# Altium project PMSM_SBC.PrjPcb
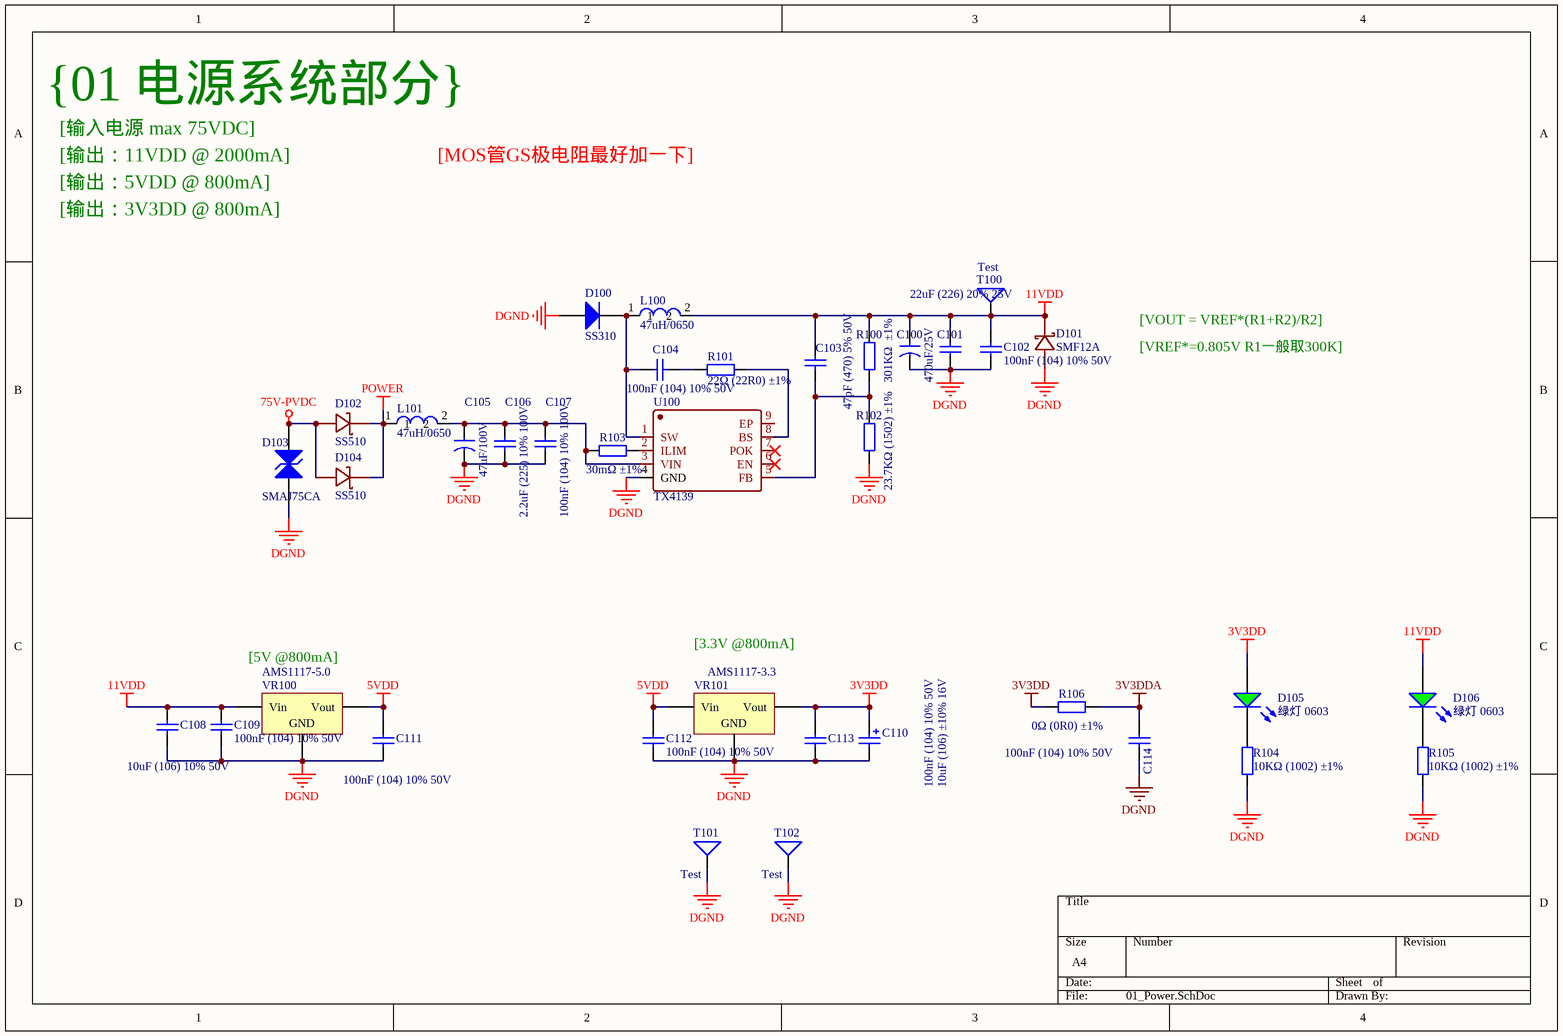
[diagram p0: 01_Power.SchDoc]
5 sheets, 177 parts. Net scope: global (net labels, ports and power ports of the same name join across sheets).
Board file: PMSM_Driver_V0.16.PcbDoc
Sheets:
  01_Power.SchDoc
  02_Sensor.SchDoc
  03_MOS_Drive.SchDoc
  04_Mcu.SchDoc
  05_Peripheral.SchDoc

## Sheet 01_Power.SchDoc
size A4

### Parts
C100  470uF/25V  [47UF/100V]
C101  22uF (226) 20% 25V  [LC-0805_C]
C102  100nF (104) 10% 50V  [LC-0603_C]
C103  47pF (470) 5% 50V  [LC-0603_C]
C104  100nF (104) 10% 50V  [LC-0603_C]
C105  47uF/100V  [47UF/100V]
C106  2.2uF (225) 10% 100V  [LC-1206_C]
C107  100nF (104) 10% 100V  [LC-1206_C]
C108  10uF (106) 10% 50V  [LC-1206_C]
C109  100nF (104) 10% 50V  [LC-0603_C]
C110  10uF (106) ±10% 16V  [LC-CASE-A_3216]
C111  100nF (104) 10% 50V  [LC-0603_C]
C112  100nF (104) 10% 50V  [LC-0603_C]
C113  100nF (104) 10% 50V  [LC-0603_C]
C114  100nF (104) 10% 50V  [LC-0603_C]
D100  SS310  [LC-SMA(DO-214AC)_S1]
D101  SMF12A  [SMF12A - duplicate]
D102  SS510  [SS510]
D103  SMAJ75CA  [LC-SMB(DO-214AA)_S1]
D104  SS510  [SS510]
D105  绿灯 0603  [LC-0603_LED_S1]
D106  绿灯 0603  [LC-0603_LED_S1]
L100  47uH/0650  [0650_47uH]
L101  47uH/0650  [0650_47uH]
R100  301KΩ  ±1%  [LC-0603_R]
R101  22Ω (22R0) ±1%  [LC-0603_R]
R102  23.7KΩ (1502) ±1%  [LC-0603_R]
R103  30mΩ ±1%  [LC-0603_R]
R104  10KΩ (1002) ±1%  [LC-0603_R]
R105  10KΩ (1002) ±1%  [LC-0603_R]
R106  0Ω (0R0) ±1%  [LC-0603_R]
T100  Test  [Testpoint]
T101  Test  [Testpoint]
T102  Test  [Testpoint]
U100  TX4139  [ESOP8]
VR100  AMS1117-5.0  [LC-SOT-223]
VR101  AMS1117-3.3  [LC-SOT-223]

### Nets
3V3DD: C110.1 C113.2 D105.A R106.1 VR101.2(Vout)
3V3DDA: C114.2 R106.2
5VDD: C111.2 C112.2 VR100.2(Vout) VR101.3(Vin)
11VDD: C100.1 C101.2 C102.2 C103.2 C108.2 C109.2 D101.1(K) D106.A L100.2 R100.2 T100.1 VR100.3(Vin)
75V-PVDC: D102.2 D103.2(K) D104.2
DGND: C100.2 C101.1 C102.1 C105.2 C106.1 C107.1 C108.1 C109.1 C110.2 C111.1 C112.1 C113.1 C114.1 D100.1(A) D101.2(A) D103.1(A) R102.1 R104.1 R105.1 T101.1 T102.1 U100.4(GND) VR100.1(GND) VR101.1(GND)
POWER: D102.1 D104.1 L101.1
NetC103_1: C103.1 R100.1 R102.2 U100.5(FB)
NetC104_1: C104.1 D100.2(K) L100.1 U100.1(SW)
NetC104_2: C104.2 R101.1
NetC105_1: C105.1 C106.2 C107.2 L101.2 R103.2 U100.3(VIN)
NetD105_K: D105.K R104.2
NetD106_K: D106.K R105.2
NetR101_2: R101.2 U100.8(BS)
NetR103_1: R103.1 U100.2(ILIM)

Not connected (* = marked no-connect by the designer): U100 6(EN)* 7(POK)* 9(EP)

### Notes on the sheet
- {01 电源系统部分}
- [输入电源 max 75VDC]
- [输出：11VDD @ 2000mA]
- [MOS管GS极电阻最好加一下]
- [输出：5VDD @ 800mA]
- [输出：3V3DD @ 800mA]
- [VOUT = VREF*(R1+R2)/R2]
- [VREF*=0.805V R1一般取300K]
- [3.3V @800mA]
- [5V @800mA]

### Library data of the parts
C100 C105 = CapSMT220u_16V
C101 = 0805 22uF (226) 20% 25V: 贴片电容; ComponentLink1Description: 供应商链接; ComponentLink1URL: http://www.szlcsc.com/product/details_46786.html; Package: 0805; Supplier: LC; SuppliersPartNumber: C45783
C102 C104 C109 C111-C114 = 0603 100nF (104) 10% 50V: 贴片电容; ComponentLink1Description: 供应商链接; ComponentLink1URL: http://www.szlcsc.com/product/details_15331.html; Package: 0603; Supplier: LC; SuppliersPartNumber: C14663
C103 = 0603 47pF (470) 5% 50V: 贴片电容; ComponentLink1Description: 供应商链接; ComponentLink1URL: http://www.szlcsc.com/product/details_2023.html; Package: 0603; Supplier: LC; SuppliersPartNumber: C1671
C106 = 1206 2.2uF (225) 10% 50V: 贴片电容; ComponentLink1Description: 供应商链接; ComponentLink1URL: http://www.szlcsc.com/product/details_13292.html; Package: 1206; Supplier: LC; SuppliersPartNumber: C12656
C107 = 1206 100nF (104) 10% 50V: 贴片电容; ComponentLink1Description: 供应商链接; ComponentLink1URL: http://www.szlcsc.com/product/details_25237.html; Package: 1206; Supplier: LC; SuppliersPartNumber: C24497
C108 = 1206 10uF (106) 10% 50V: 贴片电容; ComponentLink1Description: 供应商链接; ComponentLink1URL: http://www.szlcsc.com/product/details_14236.html; Package: 1206; Supplier: LC; SuppliersPartNumber: C13585
C110 = 3216 10uF (106) 10% 16V: 钽电容; ComponentLink1Description: 供应商链接; ComponentLink1URL: http://www.szlcsc.com/product/details_7643.html; Package: 3216; Supplier: LC; SuppliersPartNumber: C7171
D100 = SMA(DO-214AC) SS54: 二极管; ComponentLink1Description: 供应商链接; ComponentLink1URL: http://www.szlcsc.com/product/details_23178.html; Package: SMA(DO-214AC); Supplier: LC; SuppliersPartNumber: C22452
D103 = SMB/DO-214AA P6SMB6.8CA: TVS; ComponentLink1Description: 供应商链接; ComponentLink1URL: http://www.szlcsc.com/product/details_79530.html; Package: SMB/DO-214AA; Supplier: LC; SuppliersPartNumber: C78395
D105 D106 = 0603 绿灯: 发光二极管; ComponentLink1Description: 供应商链接; ComponentLink1URL: http://www.szlcsc.com/product/details_73152.html; Package: 0603; Supplier: LC; SuppliersPartNumber: C72043
L100 L101 = Inductor
R100 = 0603 330KΩ (3303) 1%: 贴片电阻; ComponentLink1Description: 供应商链接; ComponentLink1URL: http://www.szlcsc.com/product/details_23864.html; Package: 0603; Supplier: LC; SuppliersPartNumber: C23137
R101 = 0603 22Ω (22R0) 1%: 贴片电阻; ComponentLink1Description: 供应商链接; ComponentLink1URL: http://www.szlcsc.com/product/details_24078.html; Package: 0603; Supplier: LC; SuppliersPartNumber: C23345
R102 = 0603 15KΩ (1502) 1%: 贴片电阻; ComponentLink1Description: 供应商链接; ComponentLink1URL: http://www.szlcsc.com/product/details_23536.html; Package: 0603; Supplier: LC; SuppliersPartNumber: C22809
R103 = 0603 100KΩ (1003) 1%: 贴片电阻; ComponentLink1Description: 供应商链接; ComponentLink1URL: http://www.szlcsc.com/product/details_26546.html; Package: 0603; Supplier: LC; SuppliersPartNumber: C25803
R104 R105 = 0603 10KΩ (1002) 1%: 贴片电阻; ComponentLink1Description: 供应商链接; ComponentLink1URL: http://www.szlcsc.com/product/details_26547.html; Package: 0603; Supplier: LC; SuppliersPartNumber: C25804
R106 = 0603 0Ω (0R0) 1%: 贴片电阻; ComponentLink1Description: 供应商链接; ComponentLink1URL: http://www.szlcsc.com/product/details_21903.html; Package: 0603; Supplier: LC; SuppliersPartNumber: C21189
T100-T102 = TestPad
VR100 = SOT-223 AMS1117-5.0: 低压差线性稳压(LDO); ComponentLink1Description: 供应商链接; ComponentLink1URL: http://www.szlcsc.com/product/details_6653.html; Package: SOT-223; Supplier: LC; SuppliersPartNumber: C6187
VR101 = SOT-223 AMS1117-3.3: 低压差线性稳压(LDO); ComponentLink1Description: 供应商链接; ComponentLink1URL: http://www.szlcsc.com/product/details_6652.html; Package: SOT-223; Supplier: LC; SuppliersPartNumber: C6186

## Sheet 02_Sensor.SchDoc
size A4
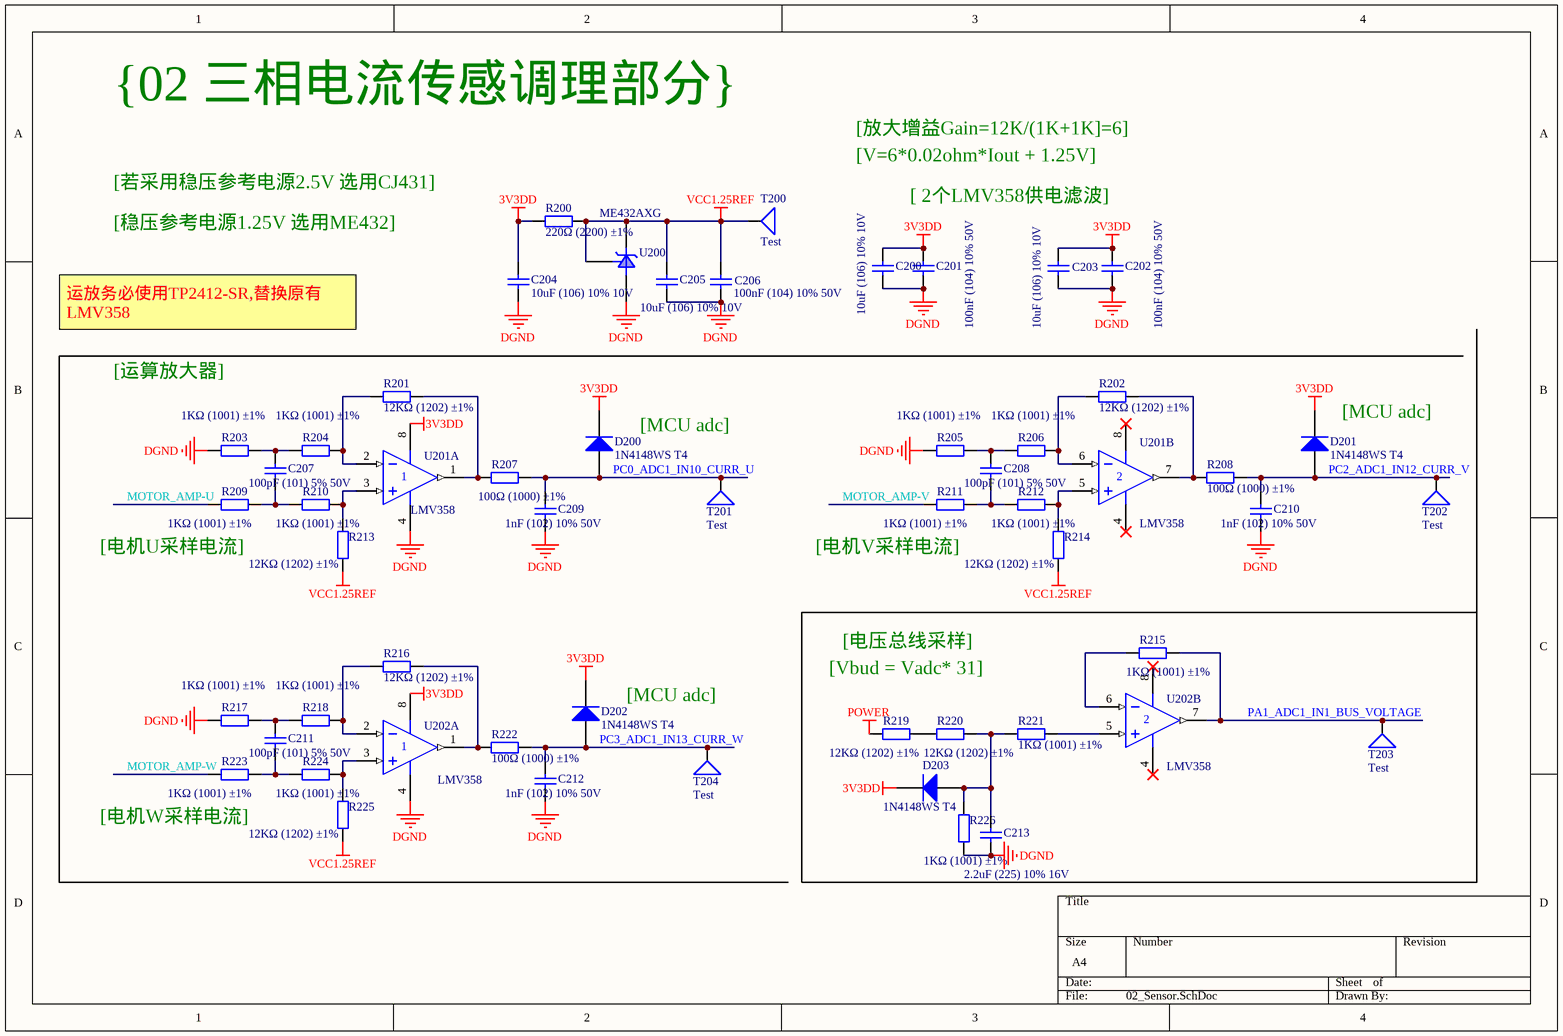
[diagram p1: 02_Sensor.SchDoc]

### Parts
C200  10uF (106) 10% 10V  [LC-0603_C]
C201  100nF (104) 10% 50V  [LC-0603_C]
C202  100nF (104) 10% 50V  [LC-0603_C]
C203  10uF (106) 10% 10V  [LC-0603_C]
C204  10uF (106) 10% 10V  [LC-0603_C]
C205  10uF (106) 10% 10V  [LC-0603_C]
C206  100nF (104) 10% 50V  [LC-0603_C]
C207  100pF (101) 5% 50V  [LC-0603_C]
C208  100pF (101) 5% 50V  [LC-0603_C]
C209  1nF (102) 10% 50V  [LC-0603_C]
C210  1nF (102) 10% 50V  [LC-0603_C]
C211  100pF (101) 5% 50V  [LC-0603_C]
C212  1nF (102) 10% 50V  [LC-0603_C]
C213  2.2uF (225) 10% 16V  [LC-0603_C]
D200  1N4148WS T4  [LC-SOD-323]
D201  1N4148WS T4  [LC-SOD-323]
D202  1N4148WS T4  [LC-SOD-323]
D203  1N4148WS T4  [LC-SOD-323]
R200  220Ω (2200) ±1%  [LC-0603_R]
R201  12KΩ (1202) ±1%  [LC-0603_R]
R202  12KΩ (1202) ±1%  [LC-0603_R]
R203  1KΩ (1001) ±1%  [LC-0603_R]
R204  1KΩ (1001) ±1%  [LC-0603_R]
R205  1KΩ (1001) ±1%  [LC-0603_R]
R206  1KΩ (1001) ±1%  [LC-0603_R]
R207  100Ω (1000) ±1%  [LC-0603_R]
R208  100Ω (1000) ±1%  [LC-0603_R]
R209  1KΩ (1001) ±1%  [LC-0603_R]
R210  1KΩ (1001) ±1%  [LC-0603_R]
R211  1KΩ (1001) ±1%  [LC-0603_R]
R212  1KΩ (1001) ±1%  [LC-0603_R]
R213  12KΩ (1202) ±1%  [LC-0603_R]
R214  12KΩ (1202) ±1%  [LC-0603_R]
R215  1KΩ (1001) ±1%  [LC-0603_R]
R216  12KΩ (1202) ±1%  [LC-0603_R]
R217  1KΩ (1001) ±1%  [LC-0603_R]
R218  1KΩ (1001) ±1%  [LC-0603_R]
R219  12KΩ (1202) ±1%  [LC-0603_R]
R220  12KΩ (1202) ±1%  [LC-0603_R]
R221  1KΩ (1001) ±1%  [LC-0603_R]
R222  100Ω (1000) ±1%  [LC-0603_R]
R223  1KΩ (1001) ±1%  [LC-0603_R]
R224  1KΩ (1001) ±1%  [LC-0603_R]
R225  12KΩ (1202) ±1%  [LC-0603_R]
R226  1KΩ (1001) ±1%  [LC-0603_R]
T200  Test  [Testpoint]
T201  Test  [Testpoint]
T202  Test  [Testpoint]
T203  Test  [Testpoint]
T204  Test  [Testpoint]
U200  ME432AXG  [LC-SOT-23(SOT-23-3)]
U201  LMV358  [TP2412-SR]  (parts A,B of 2)
U202  LMV358  [TP2412-SR]  (parts A,B of 2)

### Nets
3V3DD: C200.2 C201.2 C202.2 C203.2 C204.2 D200.2(K) D201.2(K) D202.2(K) D203.2(K) R200.1 U201.8(V+) U202.8(V+)
DGND: C200.1 C201.1 C202.1 C203.1 C204.1 C205.1 C206.1 C209.1 C210.1 C212.1 C213.1 R203.1 R205.1 R217.1 R226.1 U200.3(A) U201.4(V-) U202.4(V-)
POWER: R219.1
VCC1.25REF: C205.2 C206.2 R200.2 R213.1 R214.1 R225.1 T200.1 U200.1(R) U200.2(K)
MOTOR_AMP-U: R209.1
MOTOR_AMP-V: R211.1
MOTOR_AMP-W: R223.1
PA1_ADC1_IN1_BUS_VOLTAGE: R215.2 T203.1 U202.7(OUT)
PC0_ADC1_IN10_CURR_U: C209.2 D200.1(A) R207.2 T201.1
PC2_ADC1_IN12_CURR_V: C210.2 D201.1(A) R208.2 T202.1
PC3_ADC1_IN13_CURR_W: C212.2 D202.1(A) R222.2 T204.1
NetC207_1: C207.1 R209.2 R210.2
NetC207_2: C207.2 R203.2 R204.2
NetC208_1: C208.1 R211.2 R212.2
NetC208_2: C208.2 R205.2 R206.2
NetC211_1: C211.1 R223.2 R224.2
NetC211_2: C211.2 R217.2 R218.2
NetC213_2: C213.2 D203.1(A) R220.2 R221.2 R226.2
NetR201_1: R201.1 R207.1 U201.1(OUT)
NetR201_2: R201.2 R204.1 U201.2(IN-)
NetR202_1: R202.1 R208.1 U201.7(OUT)
NetR202_2: R202.2 R206.1 U201.6(IN-)
NetR210_1: R210.1 R213.2 U201.3(IN+)
NetR212_1: R212.1 R214.2 U201.5(IN+)
NetR215_1: R215.1 U202.6(IN-)
NetR216_1: R216.1 R222.1 U202.1(OUT)
NetR216_2: R216.2 R218.1 U202.2(IN-)
NetR219_2: R219.2 R220.1
NetR221_1: R221.1 U202.5(IN+)
NetR224_1: R224.1 R225.2 U202.3(IN+)

### Notes on the sheet
- {02 三相电流传感调理部分}
- [放大增益Gain=12K/(1K+1K]=6]
- [V=6*0.02ohm*Iout + 1.25V]
- [若采用稳压参考电源2.5V 选用CJ431]
- [稳压参考电源1.25V 选用ME432]
- [ 2个LMV358供电滤波]
- 运放务必使用TP2412-SR,替换原有LMV358
- [运算放大器]
- [MCU adc]
- (near D201) [MCU adc]
- (near R209) [电机U采样电流]
- (near R211) [电机V采样电流]
- [电压总线采样]
- [Vbud = Vadc* 31]
- (near R223) [电机W采样电流]

### Library data of the parts
C200 C203-C205 = 0603 10uF (106) 10% 10V: 贴片电容; ComponentLink1Description: 供应商链接; ComponentLink1URL: http://www.szlcsc.com/product/details_20411.html; Package: 0603; Supplier: LC; SuppliersPartNumber: C19702
C201 C202 C206 = 0603 100nF (104) 10% 50V: 贴片电容; ComponentLink1Description: 供应商链接; ComponentLink1URL: http://www.szlcsc.com/product/details_15331.html; Package: 0603; Supplier: LC; SuppliersPartNumber: C14663
C207 C208 C211 = 0603 100pF (101) 5% 50V: 贴片电容; ComponentLink1Description: 供应商链接; ComponentLink1URL: http://www.szlcsc.com/product/details_15530.html; Package: 0603; Supplier: LC; SuppliersPartNumber: C14858
C209 C210 C212 = 0603 1nF (102) 10% 50V: 贴片电容; ComponentLink1Description: 供应商链接; ComponentLink1URL: http://www.szlcsc.com/product/details_1940.html; Package: 0603; Supplier: LC; SuppliersPartNumber: C1588
C213 = 0603 2.2uF (225) 10% 16V: 贴片电容; ComponentLink1Description: 供应商链接; ComponentLink1URL: http://www.szlcsc.com/product/details_24366.html; Package: 0603; Supplier: LC; SuppliersPartNumber: C23630
D200-D203 = SOD-323 1N4148WS T4: 二极管; ComponentLink1Description: 供应商链接; ComponentLink1URL: http://www.szlcsc.com/product/details_2485.html; Package: SOD-323; Supplier: LC; SuppliersPartNumber: C2128
R200 = 0603 220Ω (2200) 1%: 贴片电阻; ComponentLink1Description: 供应商链接; ComponentLink1URL: http://www.szlcsc.com/product/details_23689.html; Package: 0603; Supplier: LC; SuppliersPartNumber: C22962
R201 R202 R213 R214 R216 R219 R220 R225 = 0603 12KΩ (1202) 1%: 贴片电阻; ComponentLink1Description: 供应商链接; ComponentLink1URL: http://www.szlcsc.com/product/details_23517.html; Package: 0603; Supplier: LC; SuppliersPartNumber: C22790
R203-R206 R209-R212 R215 R217 R218 R221 R223 R224 R226 = 0603 1KΩ (1001) 1%: 贴片电阻; ComponentLink1Description: 供应商链接; ComponentLink1URL: http://www.szlcsc.com/product/details_21904.html; Package: 0603; Supplier: LC; SuppliersPartNumber: C21190
R207 R208 R222 = 0603 100Ω (1000) 1%: 贴片电阻; ComponentLink1Description: 供应商链接; ComponentLink1URL: http://www.szlcsc.com/product/details_23502.html; Package: 0603; Supplier: LC; SuppliersPartNumber: C22775
T200-T204 = TestPad
U200 = CJ431 0.5%431: 电压基准; ComponentLink1Description: 供应商链接; ComponentLink1URL: http://www.szlcsc.com/product/details_3500.html; Package: SOT-23; Supplier: LC; SuppliersPartNumber: C3113
U201 U202 = LM358DR2G: 通用运放; ComponentLink1Description: 供应商链接; ComponentLink1URL: http://www.szlcsc.com/product/details_8427.html; Package: SOIC-8; Supplier: LC; SuppliersPartNumber: C7950

## Sheet 03_MOS_Drive.SchDoc
size A3
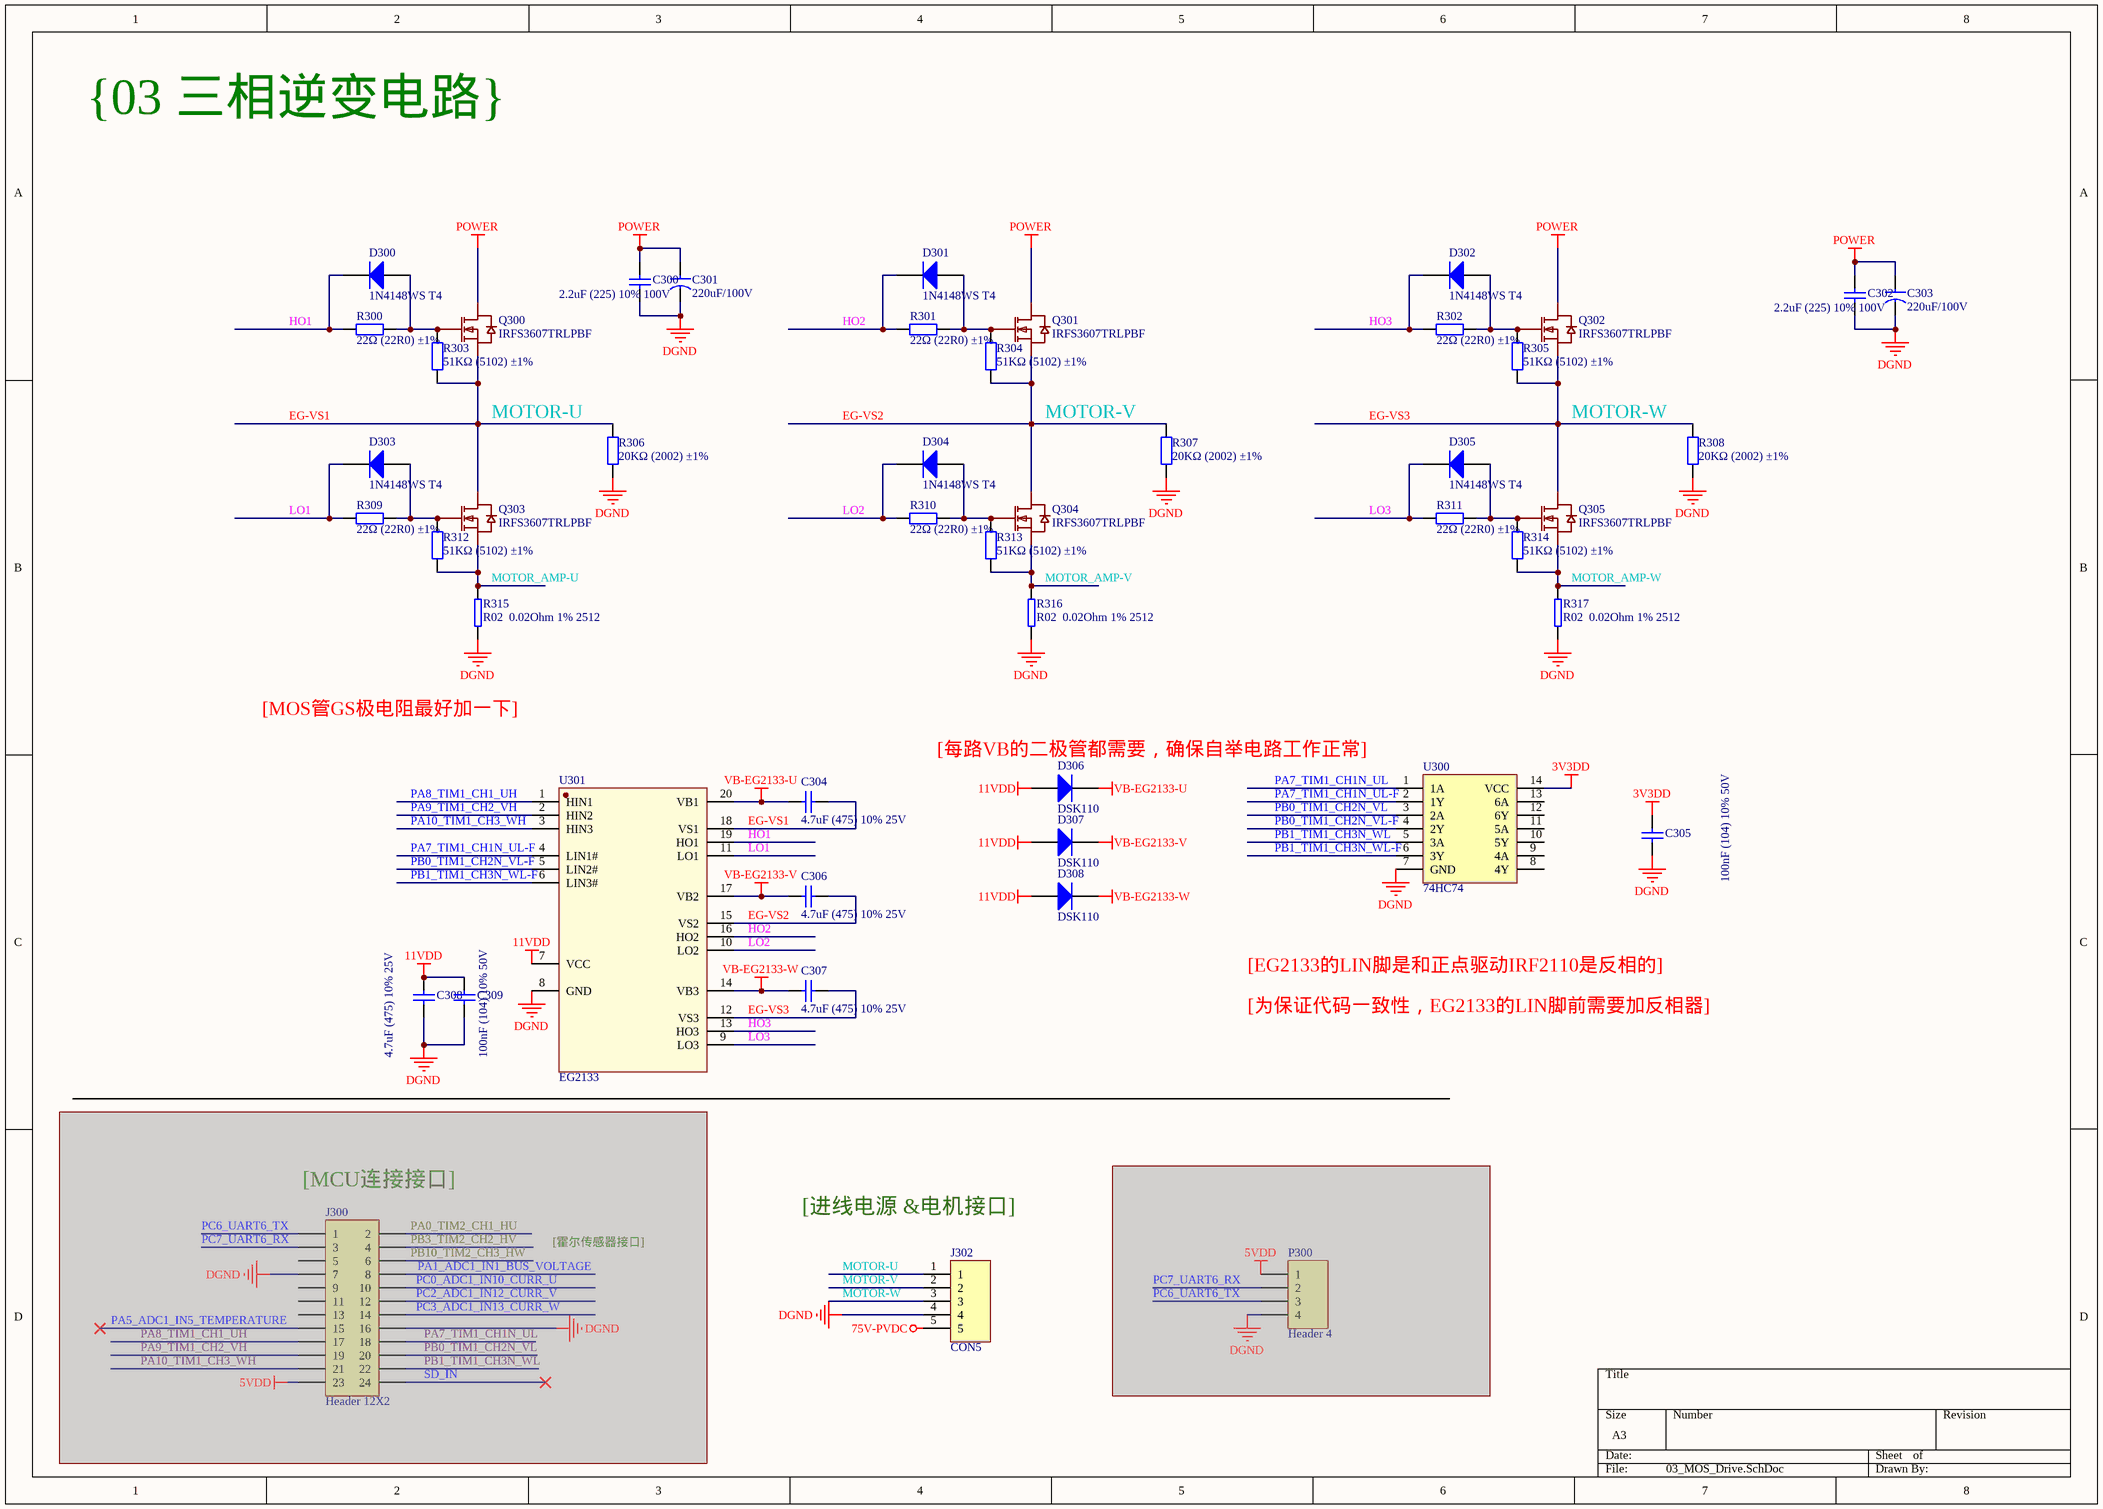
[diagram p2: 03_MOS_Drive.SchDoc]

### Parts
C300  2.2uF (225) 10% 100V  [LC-1206_C]
C301  220uF/100V  [220UF/100V]
C302  2.2uF (225) 10% 100V  [LC-1206_C]
C303  220uF/100V  [220UF/100V]
C304  4.7uF (475) 10% 25V  [LC-0805_C]
C305  100nF (104) 10% 50V  [LC-0603_C]
C306  4.7uF (475) 10% 25V  [LC-0805_C]
C307  4.7uF (475) 10% 25V  [LC-0805_C]
C308  4.7uF (475) 10% 25V  [LC-0603_C]
C309  100nF (104) 10% 50V  [LC-0603_C]
D300  1N4148WS T4  [LC-SOD-323]
D301  1N4148WS T4  [LC-SOD-323]
D302  1N4148WS T4  [LC-SOD-323]
D303  1N4148WS T4  [LC-SOD-323]
D304  1N4148WS T4  [LC-SOD-323]
D305  1N4148WS T4  [LC-SOD-323]
D306  DSK110  [DSK110]
D307  DSK110  [DSK110]
D308  DSK110  [DSK110]
J300  Header 12X2  [HDR2X12]  (masked out: inside a compile mask, not in the netlist)
J302  CON5  [7.62-5P 端子]
P300  Header 4  [HDR1X4]  (masked out: inside a compile mask, not in the netlist)
Q300  IRFS3607TRLPBF  [TO-263-2]
Q301  IRFS3607TRLPBF  [TO-263-2]
Q302  IRFS3607TRLPBF  [TO-263-2]
Q303  IRFS3607TRLPBF  [TO-263-2]
Q304  IRFS3607TRLPBF  [TO-263-2]
Q305  IRFS3607TRLPBF  [TO-263-2]
R300  22Ω (22R0) ±1%  [LC-0603_R]
R301  22Ω (22R0) ±1%  [LC-0603_R]
R302  22Ω (22R0) ±1%  [LC-0603_R]
R303  51KΩ (5102) ±1%  [LC-0603_R]
R304  51KΩ (5102) ±1%  [LC-0603_R]
R305  51KΩ (5102) ±1%  [LC-0603_R]
R306  20KΩ (2002) ±1%  [LC-0603_R]
R307  20KΩ (2002) ±1%  [LC-0603_R]
R308  20KΩ (2002) ±1%  [LC-0603_R]
R309  22Ω (22R0) ±1%  [LC-0603_R]
R310  22Ω (22R0) ±1%  [LC-0603_R]
R311  22Ω (22R0) ±1%  [LC-0603_R]
R312  51KΩ (5102) ±1%  [LC-0603_R]
R313  51KΩ (5102) ±1%  [LC-0603_R]
R314  51KΩ (5102) ±1%  [LC-0603_R]
R315  R02  0.02Ohm 1% 2512  [R2512]
R316  R02  0.02Ohm 1% 2512  [R2512]
R317  R02  0.02Ohm 1% 2512  [R2512]
U300  74HC74  [SOIC-14]
U301  EG2133  [TSSOP20]

### Nets
3V3DD: C305.2 U300.14(VCC)
11VDD: C308.2 C309.2 D306.2(A) D307.2(A) D308.2(A) U301.7(VCC)
75V-PVDC: J302.5
DGND: C300.2 C301.2 C302.2 C303.2 C305.1 C308.1 C309.1 J302.4 R306.1 R307.1 R308.1 R315.1 R316.1 R317.1 U300.7(GND) U301.8(GND)
POWER: C300.1 C301.1 C302.1 C303.1 Q300.4(D) Q301.4(D) Q302.4(D)
VB-EG2133-U: C304.1 D306.1(K) U301.20(VB1)
VB-EG2133-V: C306.1 D307.1(K) U301.17(VB2)
VB-EG2133-W: C307.1 D308.1(K) U301.14(VB3)
EG-VS1: C304.2 J302.1 Q300.3(S) Q303.4(D) R303.1 R306.2 U301.18(VS1)  [also labelled MOTOR-U]
EG-VS2: C306.2 J302.2 Q301.3(S) Q304.4(D) R304.1 R307.2 U301.15(VS2)  [also labelled MOTOR-V]
EG-VS3: C307.2 J302.3 Q302.3(S) Q305.4(D) R305.1 R308.2 U301.12(VS3)  [also labelled MOTOR-W]
HO1: D300.2(K) R300.1 U301.19(HO1)
HO2: D301.2(K) R301.1 U301.16(HO2)
HO3: D302.2(K) R302.1 U301.13(HO3)
LO1: D303.2(K) R309.1 U301.11(LO1)
LO2: D304.2(K) R310.1 U301.10(LO2)
LO3: D305.2(K) R311.1 U301.9(LO3)
MOTOR_AMP-U: Q303.3(S) R312.1 R315.2
MOTOR_AMP-V: Q304.3(S) R313.1 R316.2
MOTOR_AMP-W: Q305.3(S) R314.1 R317.2
PA7_TIM1_CH1N_UL: U300.1(1A)
PA7_TIM1_CH1N_UL-F: U300.2(1Y) U301.4(LIN1#)
PA8_TIM1_CH1_UH: U301.1(HIN1)
PA9_TIM1_CH2_VH: U301.2(HIN2)
PA10_TIM1_CH3_WH: U301.3(HIN3)
PB0_TIM1_CH2N_VL: U300.3(2A)
PB0_TIM1_CH2N_VL-F: U300.4(2Y) U301.5(LIN2#)
PB1_TIM1_CH3N_WL: U300.5(3A)
PB1_TIM1_CH3N_WL-F: U300.6(3Y) U301.6(LIN3#)
NetD300_1: D300.1(A) Q300.1(G) R300.2 R303.2
NetD301_1: D301.1(A) Q301.1(G) R301.2 R304.2
NetD302_1: D302.1(A) Q302.1(G) R302.2 R305.2
NetD303_1: D303.1(A) Q303.1(G) R309.2 R312.2
NetD304_1: D304.1(A) Q304.1(G) R310.2 R313.2
NetD305_1: D305.1(A) Q305.1(G) R311.2 R314.2

Not connected (* = marked no-connect by the designer): U300 8(4Y) 9(4A) 10(5Y) 11(5A) 12(6Y) 13(6A)

### Notes on the sheet
- {03 三相逆变电路}
- [MOS管GS极电阻最好加一下]
- (near D306) [每路VB的二极管都需要，确保自举电路工作正常]
- [EG2133的LIN脚是和正点驱动IRF2110是反相的]
- [为保证代码一致性，EG2133的LIN脚前需要加反相器]
- (near J300) [MCU连接接口]
- [霍尔传感器接口]
- [进线电源 &电机接口]

### Library data of the parts
C300 C302 = 1206 2.2uF (225) 10% 50V: 贴片电容; ComponentLink1Description: 供应商链接; ComponentLink1URL: http://www.szlcsc.com/product/details_13292.html; Package: 1206; Supplier: LC; SuppliersPartNumber: C12656
C301 C303 = CapSMT220u_16V
C304 C306 C307 = 0805 4.7uF (475) 10% 25V: 贴片电容; ComponentLink1Description: 供应商链接; ComponentLink1URL: http://www.szlcsc.com/product/details_2131.html; Package: 0805; Supplier: LC; SuppliersPartNumber: C1779
C305 C309 = 0603 100nF (104) 10% 50V: 贴片电容; ComponentLink1Description: 供应商链接; ComponentLink1URL: http://www.szlcsc.com/product/details_15331.html; Package: 0603; Supplier: LC; SuppliersPartNumber: C14663
C308 = 0603 4.7uF (475) 10% 16V: 贴片电容; ComponentLink1Description: 供应商链接; ComponentLink1URL: http://www.szlcsc.com/product/details_20375.html; Package: 0603; Supplier: LC; SuppliersPartNumber: C19666
D300-D305 = SOD-323 1N4148WS T4: 二极管; ComponentLink1Description: 供应商链接; ComponentLink1URL: http://www.szlcsc.com/product/details_2485.html; Package: SOD-323; Supplier: LC; SuppliersPartNumber: C2128
D306-D308 = SMA(DO-214AC) SS54: 二极管; ComponentLink1Description: 供应商链接; ComponentLink1URL: http://www.szlcsc.com/product/details_23178.html; Package: SMA(DO-214AC); Supplier: LC; SuppliersPartNumber: C22452
J300 = Header 12X2: Header, 12-Pin, Dual row; LatestRevisionDate: 17-Jul-2002; LatestRevisionNote: Re-released for DXP Platform.; Publisher: Altium Limited
P300 = Header 4: Header, 4-Pin; LatestRevisionDate: 17-Jul-2002; LatestRevisionNote: Re-released for DXP Platform.; Publisher: Altium Limited
R300-R302 R309-R311 = 0603 22Ω (22R0) 1%: 贴片电阻; ComponentLink1Description: 供应商链接; ComponentLink1URL: http://www.szlcsc.com/product/details_24078.html; Package: 0603; Supplier: LC; SuppliersPartNumber: C23345
R303-R305 R312-R314 = 0603 51KΩ (5102) 1%: 贴片电阻; ComponentLink1Description: 供应商链接; ComponentLink1URL: http://www.szlcsc.com/product/details_23923.html; Package: 0603; Supplier: LC; SuppliersPartNumber: C23196
R306-R308 = 0603 20KΩ (2002) 1%: 贴片电阻; ComponentLink1Description: 供应商链接; ComponentLink1URL: http://www.szlcsc.com/product/details_4591.html; Package: 0603; Supplier: LC; SuppliersPartNumber: C4184
R315-R317 = Res10K
U300 = 74HC14

## Sheet 04_Mcu.SchDoc
size A4
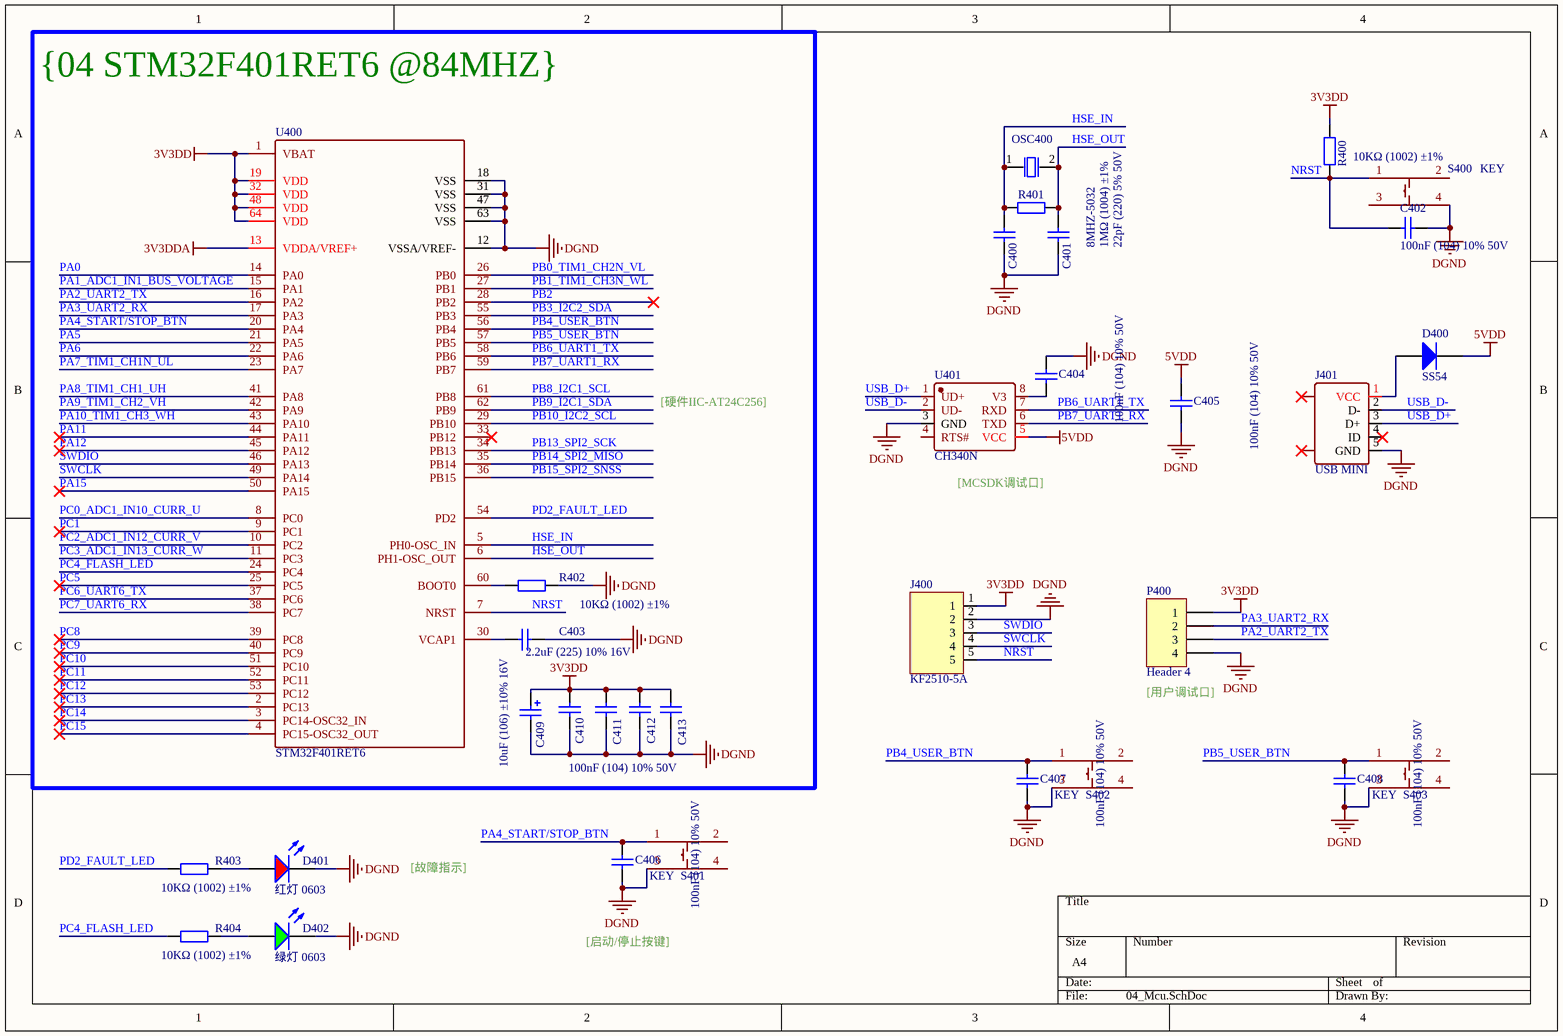
[diagram p3: 04_Mcu.SchDoc]

### Parts
C400  22pF (220) 5% 50V  [LC-0603_C]
C401  22pF (220) 5% 50V  [LC-0603_C]  (value not drawn)
C402  100nF (104) 10% 50V  [LC-0603_C]
C403  2.2uF (225) 10% 16V  [LC-0603_C]
C404  100nF (104) 10% 50V  [LC-0603_C]
C405  100nF (104) 10% 50V  [LC-0603_C]
C406  100nF (104) 10% 50V  [LC-0603_C]
C407  100nF (104) 10% 50V  [LC-0603_C]
C408  100nF (104) 10% 50V  [LC-0603_C]
C409  10uF (106) ±10% 16V  [LC-CASE-A_3216]
C410  100nF (104) 10% 50V  [LC-0603_C]
C411  100nF (104) 10% 50V  [LC-0603_C]  (value not drawn)
C412  100nF (104) 10% 50V  [LC-0603_C]  (value not drawn)
C413  100nF (104) 10% 50V  [LC-0603_C]  (value not drawn)
D400  SS54  [SS54]
D401  红灯 0603  [LC-0603_LED_S1]
D402  绿灯 0603  [LC-0603_LED_S1]
J400  KF2510-5A  [KF2510-5A]
J401  USB MINI  [USB_MINI]
OSC400  8MHZ-5032  [8MHZ-5032]
P400  Header 4  [2.54_4P_PIN]
R400  10KΩ (1002) ±1%  [LC-0603_R]
R401  1MΩ (1004) ±1%  [LC-0603_R]
R402  10KΩ (1002) ±1%  [LC-0603_R]
R403  10KΩ (1002) ±1%  [LC-0603_R]
R404  10KΩ (1002) ±1%  [LC-0603_R]
S400  KEY  [KEY_WHITE]
S401  KEY  [KEY_WHITE]
S402  KEY  [KEY_WHITE]
S403  KEY  [KEY_WHITE]
U400  STM32F401RET6  [STM32F401RET6]
U401  CH340N  [CH340N]

### Blocks framed on the sheet
{04 STM32F401RET6 @84MHZ}: C403 C409-C413 R402 U400

### Nets
3V3DD: C409.1 C410.2 C411.2 C412.2 C413.2 J400.1 P400.1 R400.2 U400.1(VBAT) U400.19(VDD) U400.32(VDD) U400.48(VDD) U400.64(VDD)
3V3DDA: U400.13(VDDA/VREF+)
5VDD: C405.2 D400.2(K) U401.5(VCC)
DGND: C400.1 C401.1 C402.1 C403.1 C404.2 C405.1 C406.1 C407.1 C408.1 C409.2 C410.1 C411.1 C412.1 C413.1 D401.K D402.K J400.2 J401.5(GND) P400.4 R402.2 S400.4 S401.3 S402.3 S403.3 U400.12(VSSA/VREF-) U400.18(VSS) U400.31(VSS) U400.47(VSS) U400.63(VSS) U401.3(GND)
HSE_IN: C400.2 OSC400.1(OSC1) R401.1 U400.5(PH0-OSC_IN)
HSE_OUT: C401.2 OSC400.2(OSC2) R401.2 U400.6(PH1-OSC_OUT)
NRST: C402.2 J400.5 R400.1 S400.1 U400.7(NRST)
PA0: U400.14(PA0)
PA1_ADC1_IN1_BUS_VOLTAGE: U400.15(PA1)
PA2_UART2_TX: P400.3 U400.16(PA2)
PA3_UART2_RX: P400.2 U400.17(PA3)
PA4_START/STOP_BTN: C406.2 S401.1 U400.20(PA4)
PA5: U400.21(PA5)
PA6: U400.22(PA6)
PA7_TIM1_CH1N_UL: U400.23(PA7)
PA8_TIM1_CH1_UH: U400.41(PA8)
PA9_TIM1_CH2_VH: U400.42(PA9)
PA10_TIM1_CH3_WH: U400.43(PA10)
PA11: U400.44(PA11)
PA12: U400.45(PA12)
PA15: U400.50(PA15)
PB0_TIM1_CH2N_VL: U400.26(PB0)
PB1_TIM1_CH3N_WL: U400.27(PB1)
PB2: U400.28(PB2)
PB3_I2C2_SDA: U400.55(PB3)
PB4_USER_BTN: C407.2 S402.1 U400.56(PB4)
PB5_USER_BTN: C408.2 S403.1 U400.57(PB5)
PB6_UART1_TX: U400.58(PB6) U401.7(RXD)
PB7_UART1_RX: U400.59(PB7) U401.6(TXD)
PB8_I2C1_SCL: U400.61(PB8)
PB9_I2C1_SDA: U400.62(PB9)
PB10_I2C2_SCL: U400.29(PB10)
PB13_SPI2_SCK: U400.34(PB13)
PB14_SPI2_MISO: U400.35(PB14)
PB15_SPI2_SNSS: U400.36(PB15)
PC0_ADC1_IN10_CURR_U: U400.8(PC0)
PC1: U400.9(PC1)
PC2_ADC1_IN12_CURR_V: U400.10(PC2)
PC3_ADC1_IN13_CURR_W: U400.11(PC3)
PC4_FLASH_LED: R404.1 U400.24(PC4)
PC5: U400.25(PC5)
PC6_UART6_TX: U400.37(PC6)
PC7_UART6_RX: U400.38(PC7)
PC8: U400.39(PC8)
PC9: U400.40(PC9)
PC10: U400.51(PC10)
PC11: U400.52(PC11)
PC12: U400.53(PC12)
PC13: U400.2(PC13)
PC14: U400.3(PC14-OSC32_IN)
PC15: U400.4(PC15-OSC32_OUT)
PD2_FAULT_LED: R403.1 U400.54(PD2)
SWCLK: J400.4 U400.49(PA14)
SWDIO: J400.3 U400.46(PA13)
USB_D+: J401.3(D+) U401.1(UD+)
USB_D-: J401.2(D-) U401.2(UD-)
NetC403_2: C403.2 U400.30(VCAP1)
NetC404_1: C404.1 U401.8(V3)
NetD400_1: D400.1(A) J401.1(VCC)
NetD401_A: D401.A R403.2
NetD402_A: D402.A R404.2
NetR402_1: R402.1 U400.60(BOOT0)

Not connected (* = marked no-connect by the designer): J401 0* 4(ID)*; S400 2 3; S401 2 4; S402 2 4; S403 2 4; U400 33(PB12)*; U401 4(RTS#)

### Notes on the sheet
- [硬件IIC-AT24C256]
- (near U401) [MCSDK调试口]
- (near P400) [用户调试口]
- [故障指示]
- [启动/停止按键]

### Library data of the parts
C400 C401 = 0603 22pF (220) 5% 50V: 贴片电容; ComponentLink1Description: 供应商链接; ComponentLink1URL: http://www.szlcsc.com/product/details_2005.html; Package: 0603; Supplier: LC; SuppliersPartNumber: C1653
C402 C404-C408 C410-C413 = 0603 100nF (104) 10% 50V: 贴片电容; ComponentLink1Description: 供应商链接; ComponentLink1URL: http://www.szlcsc.com/product/details_15331.html; Package: 0603; Supplier: LC; SuppliersPartNumber: C14663
C403 = 0603 2.2uF (225) 10% 16V: 贴片电容; ComponentLink1Description: 供应商链接; ComponentLink1URL: http://www.szlcsc.com/product/details_24366.html; Package: 0603; Supplier: LC; SuppliersPartNumber: C23630
C409 = 3216 10uF (106) 10% 16V: 钽电容; ComponentLink1Description: 供应商链接; ComponentLink1URL: http://www.szlcsc.com/product/details_7643.html; Package: 3216; Supplier: LC; SuppliersPartNumber: C7171
D400 = SMA(DO-214AC) SS54: 二极管; ComponentLink1Description: 供应商链接; ComponentLink1URL: http://www.szlcsc.com/product/details_23178.html; Package: SMA(DO-214AC); Supplier: LC; SuppliersPartNumber: C22452
D401 = 0603 红灯: 发光二极管; ComponentLink1Description: 供应商链接; ComponentLink1URL: http://www.szlcsc.com/product/details_2659.html; Package: 0603; Supplier: LC; SuppliersPartNumber: C2286
D402 = 0603 绿灯: 发光二极管; ComponentLink1Description: 供应商链接; ComponentLink1URL: http://www.szlcsc.com/product/details_73152.html; Package: 0603; Supplier: LC; SuppliersPartNumber: C72043
P400 = Header 4: Header, 4-Pin; LatestRevisionDate: 17-Jul-2002; LatestRevisionNote: Re-released for DXP Platform.; Publisher: Altium Limited
R400 R402-R404 = 0603 10KΩ (1002) 1%: 贴片电阻; ComponentLink1Description: 供应商链接; ComponentLink1URL: http://www.szlcsc.com/product/details_26547.html; Package: 0603; Supplier: LC; SuppliersPartNumber: C25804
R401 = 0603 1MΩ (1004) 1%: 贴片电阻; ComponentLink1Description: 供应商链接; ComponentLink1URL: http://www.szlcsc.com/product/details_23662.html; Package: 0603; Supplier: LC; SuppliersPartNumber: C22935
S400-S403 = KEY: 白色方块

## Sheet 05_Peripheral.SchDoc
size A4
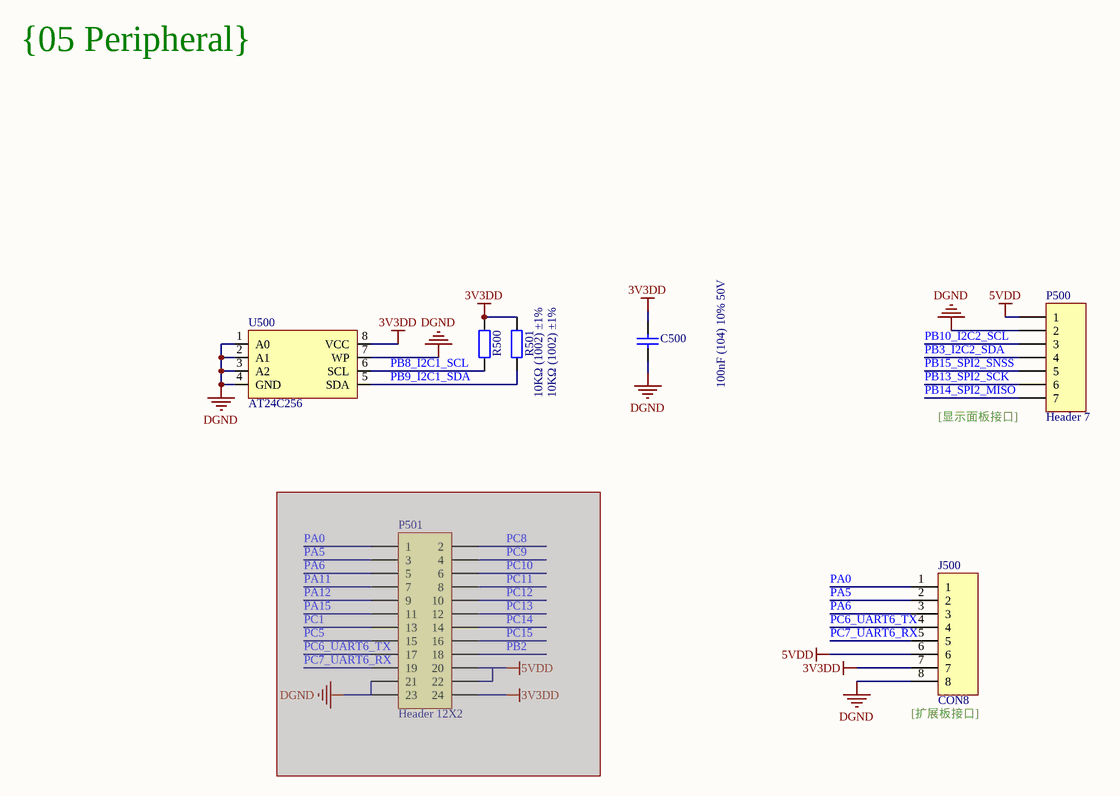
[diagram p4: 05_Peripheral.SchDoc]

### Parts
C500  100nF (104) 10% 50V  [LC-0603_C]
J500  CON8  [2.54_8P_PHI]
P500  Header 7  [XH2.54-7P]
P501  Header 12X2  [HDR2X12]  (masked out: inside a compile mask, not in the netlist)
R500  10KΩ (1002) ±1%  [LC-0603_R]
R501  10KΩ (1002) ±1%  [LC-0603_R]
U500  AT24C256  [SOIC8]

### Nets
3V3DD: C500.2 J500.7 R500.2 R501.2 U500.8(VCC)
5VDD: J500.6 P500.1
DGND: C500.1 J500.8 P500.2 U500.1(A0) U500.2(A1) U500.3(A2) U500.4(GND) U500.7(WP)
PA0: J500.1
PA5: J500.2
PA6: J500.3
PB3_I2C2_SDA: P500.4
PB8_I2C1_SCL: R500.1 U500.6(SCL)
PB9_I2C1_SDA: R501.1 U500.5(SDA)
PB10_I2C2_SCL: P500.3
PB13_SPI2_SCK: P500.6
PB14_SPI2_MISO: P500.7
PB15_SPI2_SNSS: P500.5
PC6_UART6_TX: J500.4
PC7_UART6_RX: J500.5

### Notes on the sheet
- {05 Peripheral}
- [显示面板接口]
- (near J500) [扩展板接口]

### Library data of the parts
C500 = 0603 100nF (104) 10% 50V: 贴片电容; ComponentLink1Description: 供应商链接; ComponentLink1URL: http://www.szlcsc.com/product/details_15331.html; Package: 0603; Supplier: LC; SuppliersPartNumber: C14663
P500 = Header 7: Header, 7-Pin; LatestRevisionDate: 17-Jul-2002; LatestRevisionNote: Re-released for DXP Platform.; Publisher: Altium Limited
P501 = Header 12X2: Header, 12-Pin, Dual row; LatestRevisionDate: 17-Jul-2002; LatestRevisionNote: Re-released for DXP Platform.; Publisher: Altium Limited
R500 R501 = 0603 10KΩ (1002) 1%: 贴片电阻; ComponentLink1Description: 供应商链接; ComponentLink1URL: http://www.szlcsc.com/product/details_26547.html; Package: 0603; Supplier: LC; SuppliersPartNumber: C25804

## Nets that join several sheets
3V3DD: 01_Power (5 pins), 02_Sensor (12 pins), 03_MOS_Drive (C305.2 U300.14), 04_Mcu (13 pins), 05_Peripheral (5 pins)
3V3DDA: 01_Power (C114.2 R106.2), 04_Mcu (U400.13)
5VDD: 01_Power (C111.2 C112.2 VR100.2 VR101.3), 04_Mcu (C405.2 D400.2 U401.5), 05_Peripheral (J500.6 P500.1)
11VDD: 01_Power (12 pins), 03_MOS_Drive (6 pins)
75V-PVDC: 01_Power (D102.2 D103.2 D104.2), 03_MOS_Drive (J302.5)
DGND: 01_Power (24 pins), 02_Sensor (18 pins), 03_MOS_Drive (16 pins), 04_Mcu (30 pins), 05_Peripheral (8 pins)
POWER: 01_Power (D102.1 D104.1 L101.1), 02_Sensor (R219.1), 03_MOS_Drive (7 pins)
MOTOR_AMP-U: 02_Sensor (R209.1), 03_MOS_Drive (Q303.3 R312.1 R315.2)
MOTOR_AMP-V: 02_Sensor (R211.1), 03_MOS_Drive (Q304.3 R313.1 R316.2)
MOTOR_AMP-W: 02_Sensor (R223.1), 03_MOS_Drive (Q305.3 R314.1 R317.2)
PA0: 04_Mcu (U400.14), 05_Peripheral (J500.1)
PA1_ADC1_IN1_BUS_VOLTAGE: 02_Sensor (R215.2 T203.1 U202.7), 04_Mcu (U400.15)
PA5: 04_Mcu (U400.21), 05_Peripheral (J500.2)
PA6: 04_Mcu (U400.22), 05_Peripheral (J500.3)
PA7_TIM1_CH1N_UL: 03_MOS_Drive (U300.1), 04_Mcu (U400.23)
PA8_TIM1_CH1_UH: 03_MOS_Drive (U301.1), 04_Mcu (U400.41)
PA9_TIM1_CH2_VH: 03_MOS_Drive (U301.2), 04_Mcu (U400.42)
PA10_TIM1_CH3_WH: 03_MOS_Drive (U301.3), 04_Mcu (U400.43)
PB0_TIM1_CH2N_VL: 03_MOS_Drive (U300.3), 04_Mcu (U400.26)
PB1_TIM1_CH3N_WL: 03_MOS_Drive (U300.5), 04_Mcu (U400.27)
PB3_I2C2_SDA: 04_Mcu (U400.55), 05_Peripheral (P500.4)
PB8_I2C1_SCL: 04_Mcu (U400.61), 05_Peripheral (R500.1 U500.6)
PB9_I2C1_SDA: 04_Mcu (U400.62), 05_Peripheral (R501.1 U500.5)
PB10_I2C2_SCL: 04_Mcu (U400.29), 05_Peripheral (P500.3)
PB13_SPI2_SCK: 04_Mcu (U400.34), 05_Peripheral (P500.6)
PB14_SPI2_MISO: 04_Mcu (U400.35), 05_Peripheral (P500.7)
PB15_SPI2_SNSS: 04_Mcu (U400.36), 05_Peripheral (P500.5)
PC0_ADC1_IN10_CURR_U: 02_Sensor (C209.2 D200.1 R207.2 T201.1), 04_Mcu (U400.8)
PC2_ADC1_IN12_CURR_V: 02_Sensor (C210.2 D201.1 R208.2 T202.1), 04_Mcu (U400.10)
PC3_ADC1_IN13_CURR_W: 02_Sensor (C212.2 D202.1 R222.2 T204.1), 04_Mcu (U400.11)
PC6_UART6_TX: 04_Mcu (U400.37), 05_Peripheral (J500.4)
PC7_UART6_RX: 04_Mcu (U400.38), 05_Peripheral (J500.5)